# EAGLE schematic bot2 (EAGLE 9.6.0)
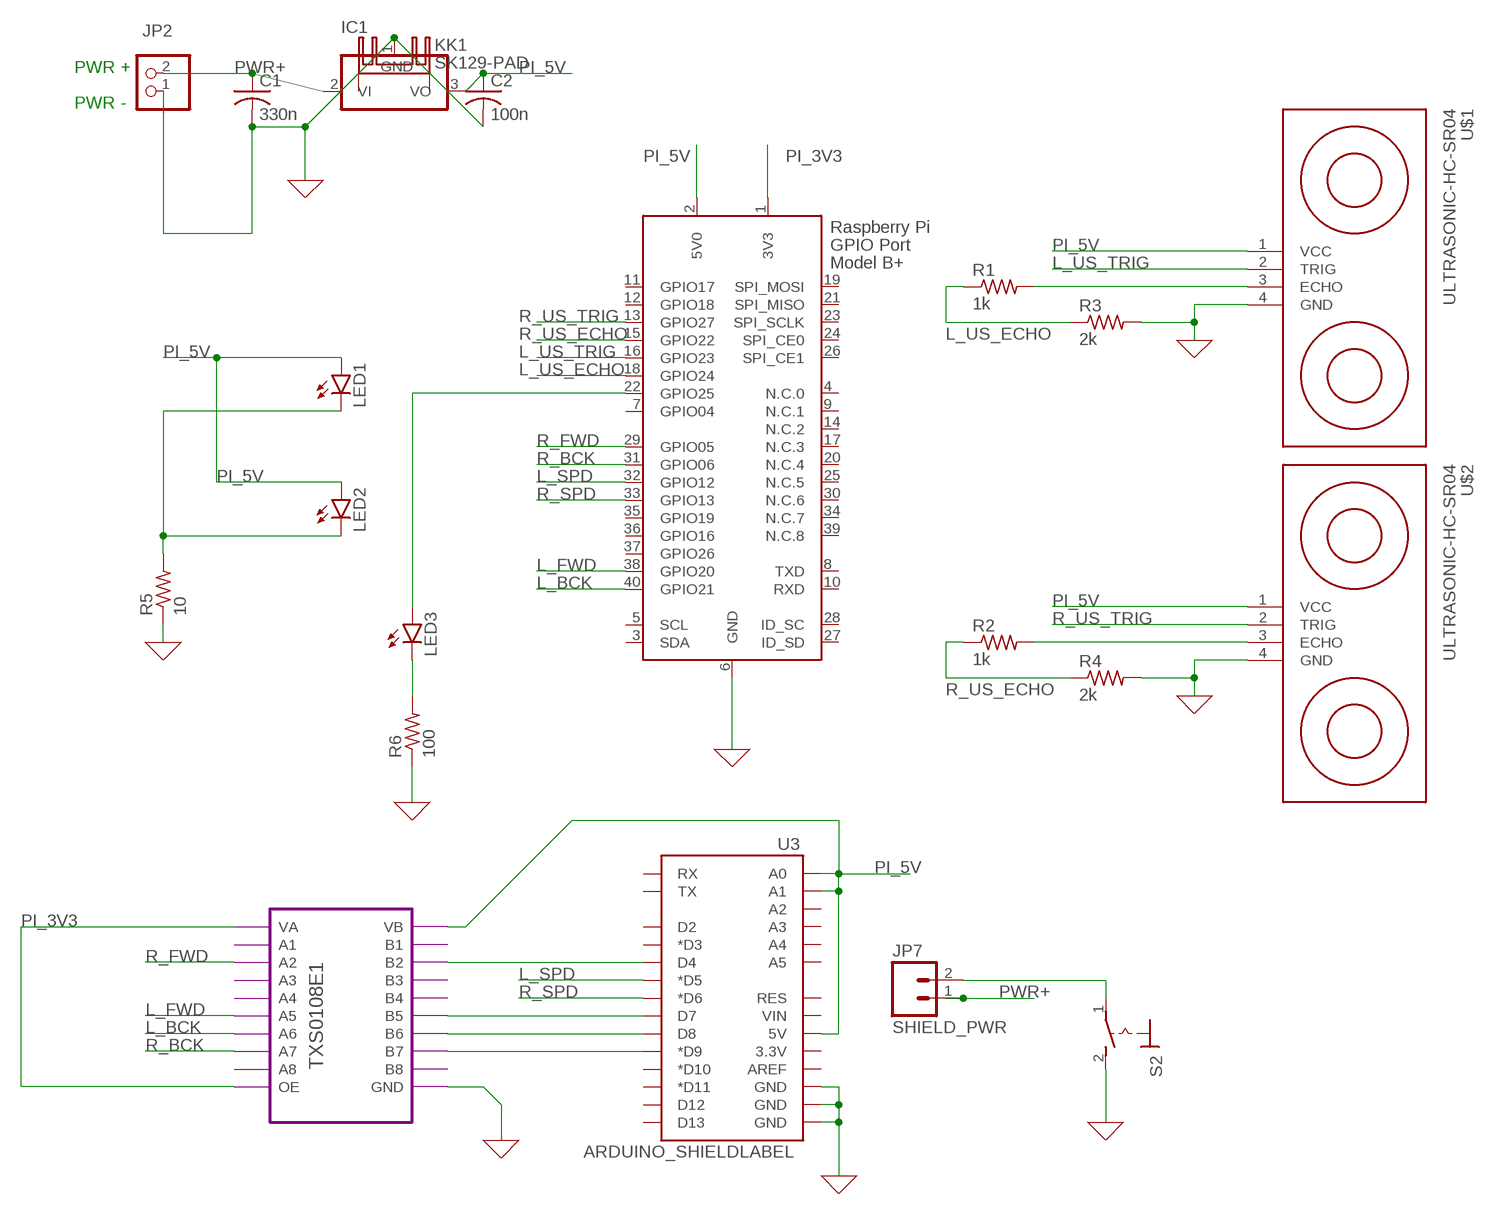
[diagram p0: schematic, sheet 1]

## Parts
C1  330n  C-US025-025X050  [C025-025X050]
C2  100n  C-US025-025X050  [C025-025X050]
IC1  7905T  [TO220H]
JP2  PINHD-1X2  [1X02]
JP7  SHIELD_PWR  M02PTH4  [1X02_XTRA_BIG]
KK1  SK129-PAD  [SK129]
LED1  LED5MM  [LED5MM]
LED2  LED5MM  [LED5MM]
LED3  LED5MM  [LED5MM]
PI  RASPI_BOARD_B+_F  [RASPI_BOARD_B+_FULL]
R1  1k  R-US_0207/10  [0207/10]
R2  1k  R-US_0207/10  [0207/10]
R3  2k  R-US_0207/10  [0207/10]
R4  2k  R-US_0207/10  [0207/10]
R5  10  R-US_0207/10  [0207/10]
R6  100  R-US_0207/10  [0207/10]
S2  MS243  [MS243]
U3  ARDUINO_SHIELDLABEL  [DUEMILANOVE_SHIELD]
U$1  ULTRASONIC-HC-SR04  [ULTRASONIC-HC-SR04]
U$2  ULTRASONIC-HC-SR04  [ULTRASONIC-HC-SR04]

## Module instances
TXS0108E1 = TXS0108E

## Nets
0: C1.2 C2.2 IC1.1(GND) JP2.1 PI.6(GND) R3.2 R4.2 R5.1 R6.1 S2.2(S) U3.GND@0(GND) U3.GND@1(GND) U3.GND@2(GND) U$1.4(GND) U$2.4(GND) ; port TXS0108E1.GND ; supply symbol labelled GND
L_BCK: PI.40(GPIO21) ; port TXS0108E1.A6
L_FWD: PI.38(GPIO20) ; port TXS0108E1.A5
L_SPD: PI.32(GPIO12) U3.D5(*D5)
L_US_ECHO: PI.18(GPIO24) R1.1 R3.1
L_US_TRIG: PI.16(GPIO23) U$1.2(TRIG)
N$1: R1.2 U$1.3(ECHO)
N$2: R2.2 U$2.3(ECHO)
N$4: LED3.A PI.22(GPIO25)
N$5: LED1.K(C) LED2.K(C) R5.2
N$6: LED3.K(C) R6.2
N$7: JP7.2 S2.1(P)
N$13: U3.D4 ; port TXS0108E1.B2
N$14: U3.D7 ; port TXS0108E1.B5
N$15: U3.D8 ; port TXS0108E1.B6
N$16: U3.D9(*D9) ; port TXS0108E1.B7
PI_3V3: PI.1(3V3) ; port TXS0108E1.OE TXS0108E1.VA
PI_5V: C2.1 IC1.3(VO) LED1.A LED2.A PI.2(5V0) U3.5V U3.A0 U3.A1 U$1.1(VCC) U$2.1(VCC) ; port TXS0108E1.VB
PWR+: C1.1 IC1.2(VI) JP2.2 JP7.1
R_BCK: PI.31(GPIO06) ; port TXS0108E1.A7
R_FWD: PI.29(GPIO05) ; port TXS0108E1.A2
R_SPD: PI.33(GPIO13) U3.D6(*D6)
R_US_ECHO: PI.15(GPIO22) R2.1 R4.1
R_US_TRIG: PI.13(GPIO27) U$2.2(TRIG)
Unconnected: KK1.A2,5(K) KK1.B2,5(K) PI.3(SDA) PI.4(N.C.0) PI.5(SCL) PI.7(GPIO04) PI.8(TXD) PI.9(N.C.1) PI.10(RXD) PI.11(GPIO17) PI.12(GPIO18) PI.14(N.C.2) PI.17(N.C.3) PI.19(SPI_MOSI) PI.20(N.C.4) PI.21(SPI_MISO) PI.23(SPI_SCLK) PI.24(SPI_CE0) PI.25(N.C.5) PI.26(SPI_CE1) PI.27(ID_SD) PI.28(ID_SC) PI.30(N.C.6) PI.34(N.C.7) PI.35(GPIO19) PI.36(GPIO16) PI.37(GPIO26) PI.39(N.C.8) U3.3.3V U3.A2 U3.A3 U3.A4 U3.A5 U3.AREF U3.D2 U3.D3(*D3) U3.D10(*D10) U3.D11(*D11) U3.D12 U3.D13 U3.RES U3.RX U3.TX U3.VIN

## Notes on the sheet
- PWR +
- PWR -

## Library data of the parts
C1 C2 = rcl:C-US: CAPACITOR, American symbol; SPICEPREFIX: C
IC1 = linearMe:79*: Negative VOLTAGE REGULATOR
JP2 = pinhead:PINHD-1X2: PIN HEADER
JP7 = SparkFun:M02: Header 2 Standard 2-pin 0.1" header. Use with straight break away headers (SKU : PRT-00116), right angle break away headers (PRT-00553), swiss pins (PRT-00743), machine pins (PRT-00117), and female headers (PRT-00115). Molex polarized connector foot print use with SKU : PRT-08233 with associated crimp pins and housings.
KK1 = heatsink:SK129-PAD: HEATSINK manufacturer Fischer/distributor Buerklin
LED1-LED3 = ledMe:LED: LED OSRAM: - CHIPLED LG R971, LG N971, LY N971, LG Q971, LY Q971, LO R971, LY R971 LH N974, LH R974 LS Q976, LO Q976, LY Q976 LO Q996 - Hyper CHIPLED LW Q18S LB Q993, LB Q99A, LB R99A - SideLED LS A670, LO A670, LY A670, LG A670, LP A670 LB A673, LV A673, LT A673, LW A673 LH A674 LY A675 LS A676, LA A676, LO A676, LY A676, LW A676 LS A679, LY A679, LG A679 - Hyper Micro SIDELED® LS Y876, LA Y876, LO Y876, LY Y876 LT Y87S - SmartLED LW L88C, LW L88S LB L89C, LB L89S, LG L890 LS L89K, LO L89K, LY L89K LS L896, LA L896, LO L896, LY L896 - TOPLED LS T670, LO T670, LY T670, LG T670, LP T670 LSG T670, LSP T670, LSY T670, LOP T670, LYG T670 LG T671, LOG T671, LSG T671 LB T673, LV T673, LT T673, LW T673 LH T674 LS T676, LA T676, LO T676, LY T676, LB T676, LH T676, LSB T676, LW T676 LB T67C, LV T67C, LT T67C, LS T67K, LO T67K, LY T67K, LW E67C LS E67B, LA E67B, LO E67B, LY E67B, LB E67C, LV E67C, LT E67C LW T67C LS T679, LY T679, LG T679 LS T770, LO T770, LY T770, LG T770, LP T770 LB T773, LV T773, LT T773, LW T773 LH T774 LS E675, LA E675, LY E675, LS T675 LS T776, LA T776, LO T776, LY T776, LB T776 LHGB T686 LT T68C, LB T68C - Hyper Mini TOPLED® LB M676 - Mini TOPLED Santana® LG M470 LS M47K, LO M47K, LY M47K Source: http://www.osram.convergy.de LUXEON: - LUMILED® LXK2-PW12-R00, LXK2-PW12-S00, LXK2-PW14-U00, LXK2-PW14-V00 LXK2-PM12-R00, LXK2-PM12-S00, LXK2-PM14-U00 LXK2-PE12-Q00, LXK2-PE12-R00, LXK2-PE12-S00, LXK2-PE14-T00, LXK2-PE14-U00 LXK2-PB12-K00, LXK2-PB12-L00, LXK2-PB12-M00, LXK2-PB14-N00, LXK2-PB14-P00, LXK2-PB14-Q00 LXK2-PR12-L00, LXK2-PR12-M00, LXK2-PR14-Q00, LXK2-PR14-R00 LXK2-PD12-Q00, LXK2-PD12-R00, LXK2-PD12-S00 LXK2-PH12-R00, LXK2-PH12-S00 LXK2-PL12-P00, LXK2-PL12-Q00, LXK2-PL12-R00 Source: www.luxeon.com KINGBRIGHT: KA-3528ASYC Source: www.kingbright.com
PI = raspberrypi_bastelstube_v13:RASPI_BOARD_B+: Raspberry Pi GPIO connector with markings for the outer dimensions of the Raspberry Pi board model B+ with different sets of drill holes or mounting pads
R1-R6 = resistor:R-US_: RESISTOR, American symbol
S2 = switch2:MS243: TOGGLE SWITCH
U3 = SparkFun:ARDUINO_SHIELD
U$1 U$2 = diy-modules:ULTRASONIC-HC-SR04: Ultrasonic Ranging Module HC-SR04 More details available here: http://randomnerdtutorials.com/complete-guide-for-ultrasonic-sensor-hc-sr04/ Click here to find device on ebay.com <http://www.ebay.com/sch/hc+sr04+ultrasonic>

## Module TXS0108E
Ports: VA(pwr) A1(io) A2(io) A3(io) A4(io) A5(io) A6(io) A7(io) A8(io) OE(in) VB(pwr) B2(io) B1(io) B3(io) B4(io) B5(io) B6(io) B7(io) B8(io) GND(pwr)
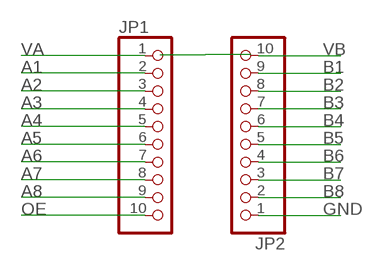
[diagram p1: schematic, module TXS0108E, sheet 1]

### Parts
JP1  PINHD-1X10  [1X10]
JP2  PINHD-1X10  [1X10]

### Nets
A1: JP1.2
A2: JP1.3
A3: JP1.4
A4: JP1.5
A5: JP1.6
A6: JP1.7
A7: JP1.8
A8: JP1.9
B1: JP2.9
B2: JP2.8
B3: JP2.7
B4: JP2.6
B5: JP2.5
B6: JP2.4
B7: JP2.3
B8: JP2.2
GND: JP2.1
OE: JP1.10
VA: JP1.1
VB: JP2.10

### Library data of the parts
JP1 JP2 = pinhead:PINHD-1X10: PIN HEADER